# EAGLE design START VARIO (EAGLE 7.5.0)
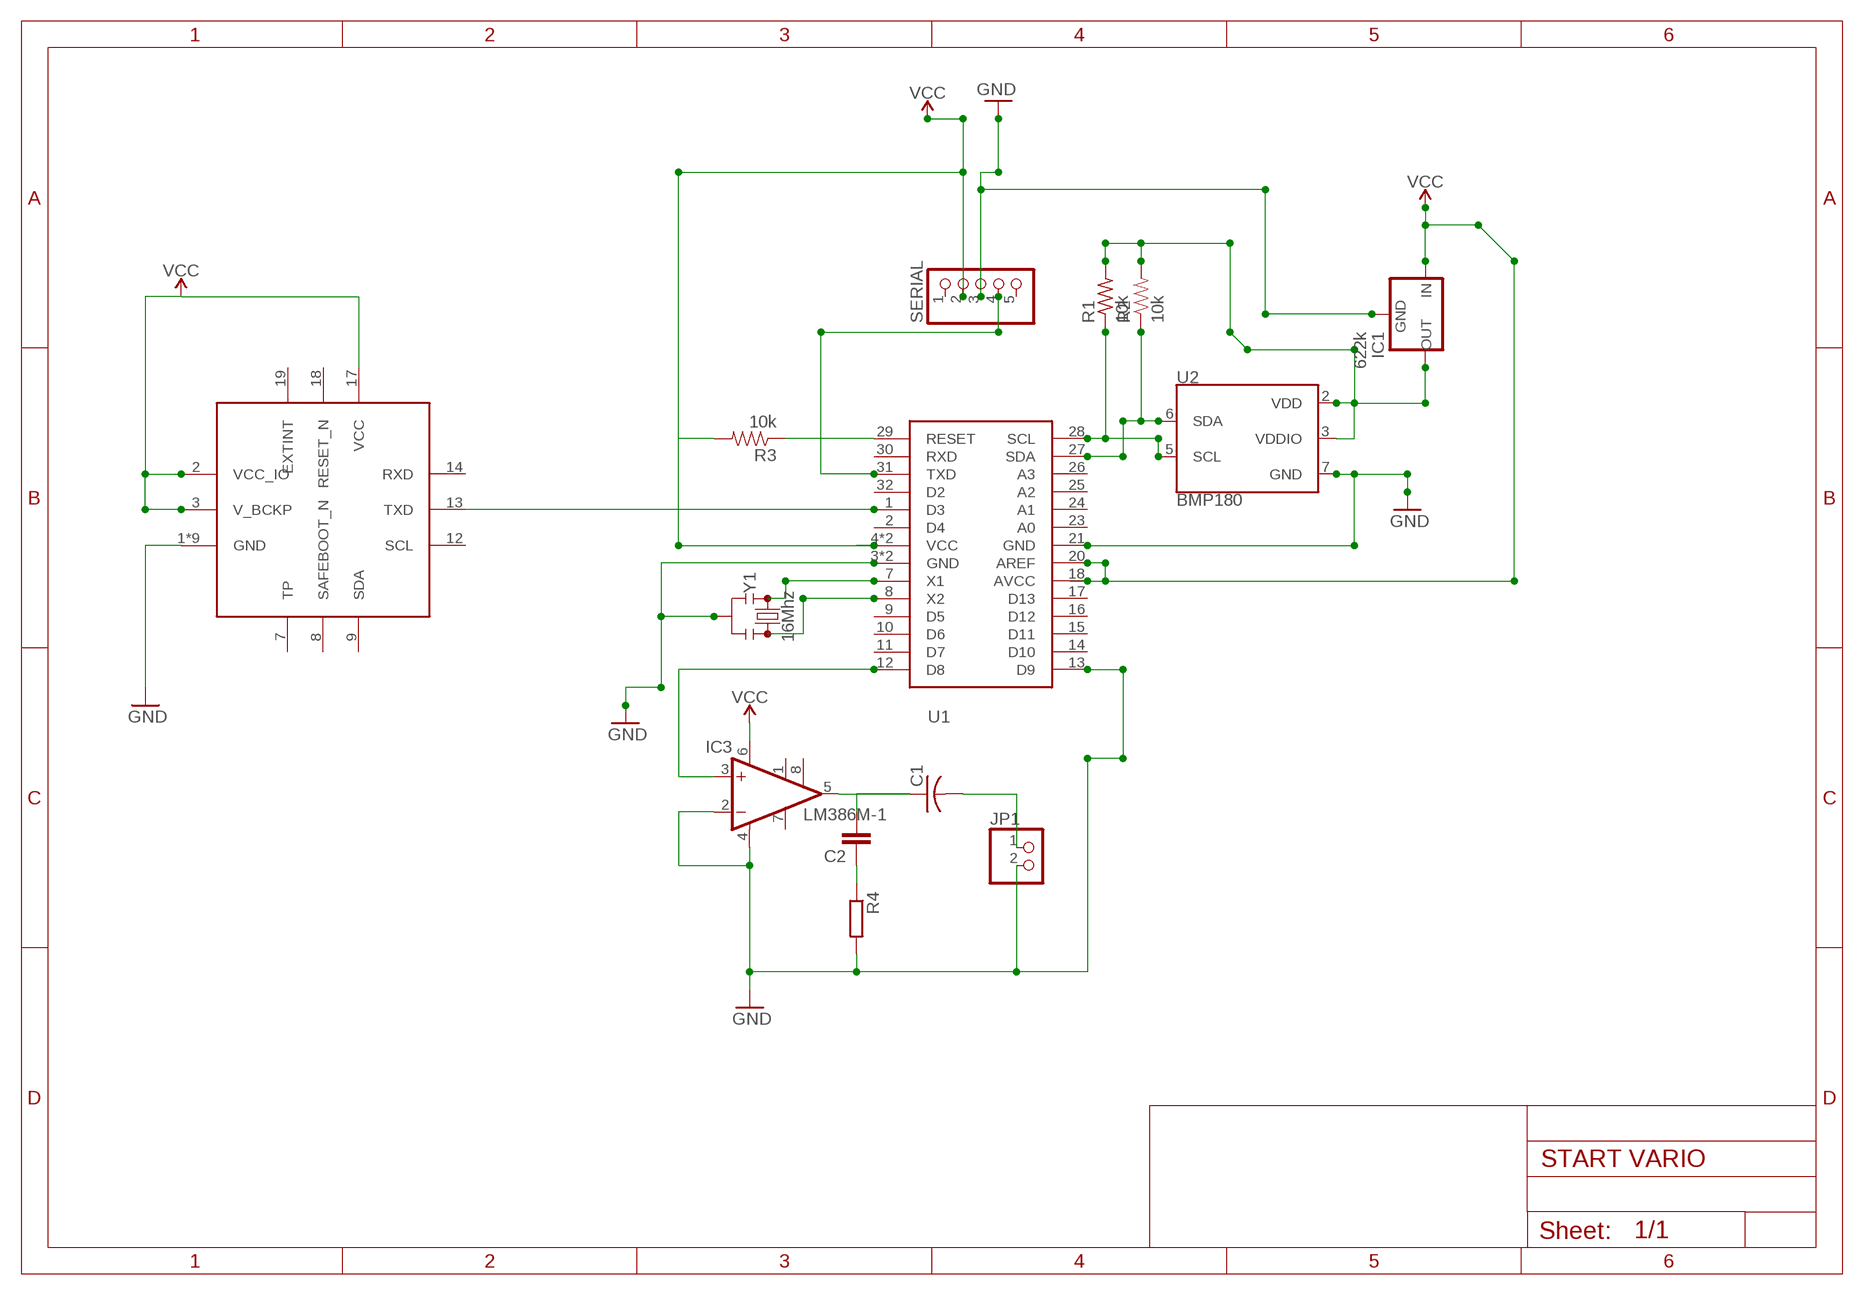
[diagram p0: schematic, sheet 1]

## Parts
C1  C-USC1608  [C1608]
C2  C-EUC0805  [C0805]
IC1  622k  XC63FPM  [SOT23]
IC2  SAM-M8Q  [SAM-M8Q]
IC3  LM386M-1  [SO08]
JP1  PINHD-1X2  [1X02]
R1  10k  R-US_R0805  [R0805]
R2  10k  RESISTOR0603-RES  [0603-RES]
R3  10k  RESISTOR0603-RES  [0603-RES]
R4  R-EU_R0805  [R0805]
SERIAL  PINHD-1X5  [1X05]
U1  ATMEGA328P  [TQFP32-08]
U2  BMP180  [BMP180]
Y1  16Mhz  RESONATORSMD-3.2X1.3  [RESONATOR-SMD-3.2X1.3]

## Nets
CN1: SERIAL.4 U1.31(TXD)
GND: IC1.1(GND) IC2.1(GND) IC2.4(GND) IC2.5(GND) IC2.6(GND) IC2.10(GND) IC2.11(GND) IC2.15(GND) IC2.16(GND) IC2.20(GND) IC3.2(-IN) IC3.4(GND) JP1.2 R4.2 SERIAL.3 U1.3(GND) U1.5(GND) U1.13(D9) U1.21(GND) U2.7(GND) Y1.2
N$1: R2.1 U1.27(SDA) U2.6(SDA)
N$2: R1.1 U1.28(SCL) U2.5(SCL)
N$3: C1.1 C2.2 IC3.5(OUT)
N$4: IC3.3(+IN) U1.12(D8)
N$5: C1.2 JP1.1
N$6: U1.7(X1) Y1.1
N$7: U1.8(X2) Y1.3
N$8: IC1.2(OUT) R1.2 R2.2 U2.2(VDD) U2.3(VDDIO)
N$9: C2.1 R4.1
N$10: R3.1 U1.29(RESET)
N$11: IC2.13(TXD) U1.1(D3)
VCC: IC1.3(IN) IC2.2(VCC_IO) IC2.3(V_BCKP) IC2.17(VCC) IC3.6(VS) R3.2 SERIAL.2 U1.4(VCC) U1.6(VCC) U1.18(AVCC) U1.20(AREF)
Unconnected: IC2.7(TP) IC2.8(SAFEBOOT_N) IC2.9(SDA) IC2.12(SCL) IC2.14(RXD) IC2.18(RESET_N) IC2.19(EXTINT) IC3.1(GAIN) IC3.7(BYPASS) IC3.8(GAIN) SERIAL.1 SERIAL.5 U1.2(D4) U1.9(D5) U1.10(D6) U1.11(D7) U1.14(D10) U1.15(D11) U1.16(D12) U1.17(D13) U1.23(A0) U1.24(A1) U1.25(A2) U1.26(A3) U1.30(RXD) U1.32(D2)

## Library data of the parts
C1 = rcl:C-US: CAPACITOR, American symbol
C2 = resistor:C-EU: CAPACITOR, European symbol
IC1 = v-reg:XC63FP: Positiv Voltage Regulators www.torex.co.jp/english/product/pro02/pdf/0201_xc62fp.pdf
IC2 = ubloxLib:SAM-M8Q: u-blox SAM GNSS antenna module
IC3 = linear:LM386?-*: Low Voltage Audio Power Amplifier Source: http://cache.national.com/ds/LM/LM386.pdf
JP1 = pinhead:PINHD-1X2: PIN HEADER
R1 = adafruit:R-US_: RESISTOR, American symbol
R2 R3 = SparkFun-Passives:RESISTOR: Resistor Basic schematic elements and footprints for 0603, 1206, and PTH resistors.
R4 = resistor:R-EU_: RESISTOR, European symbol
SERIAL = pinhead:PINHD-1X5: PIN HEADER
U1 = lightsuits:ATMEGA328P
U2 = SparkFun-Sensors:BMP180: Bosch BMP180 Digital Barometric Pressures Sensor The BMP180 is the function compatible successor of the BMP085, a new generation of high precision digital pressure sensors for consumer applications. The ultra-low power, low voltage electronics of the BMP180 is optimized for use in mobile phones, PDAs, GPS navigation devices and outdoor equipment. With a low altitude noise of merely 0.25m at fast conversion time, the BMP180 offers superior performance. The I2C interface allows for easy system integration with a microcontroller. The BMP180 is based on piezo-resistive technology for EMC robustness, high accuracy and linearity as well as long term stability. Web page: http://www.bosch-sensortec.com/en/homepage/products_3/environmental_sensors_1/bmp180_1/bmp180 Datasheet: http://ae-bst.resource.bosch.com/media/products/dokumente/bmp180/BST-BMP180-DS000-09.pdf SparkFun Products Barometric Pressure Sensor - BMP180 <https://www.sparkfun.com/products/11823> (COM-11823) SparkFun Barometric Pressure Sensor Breakout - BMP180 <https://www.sparkfun.com/products/11824> (SEN-11824); PROD_ID: IC-11600; SF_ID: 11823
Y1 = SparkFun-Clocks:RESONATOR: Resonators (Generic) Ceramic resonators are clock-generating components, often used to control timing in microcontrollers. They usually have 3 pins: two pins for oscillation, and one pin for ground. Compared to crystals, resonators have worse tolerance, but are usually much cheaper. Plus, they have built-in load capacitors! These devices are used on boards like the Arduino Pro 8MHz <https://www.sparkfun.com/products/11114> and Arduino Pro 16MHz <https://www.sparkfun.com/products/11113>.

## Board
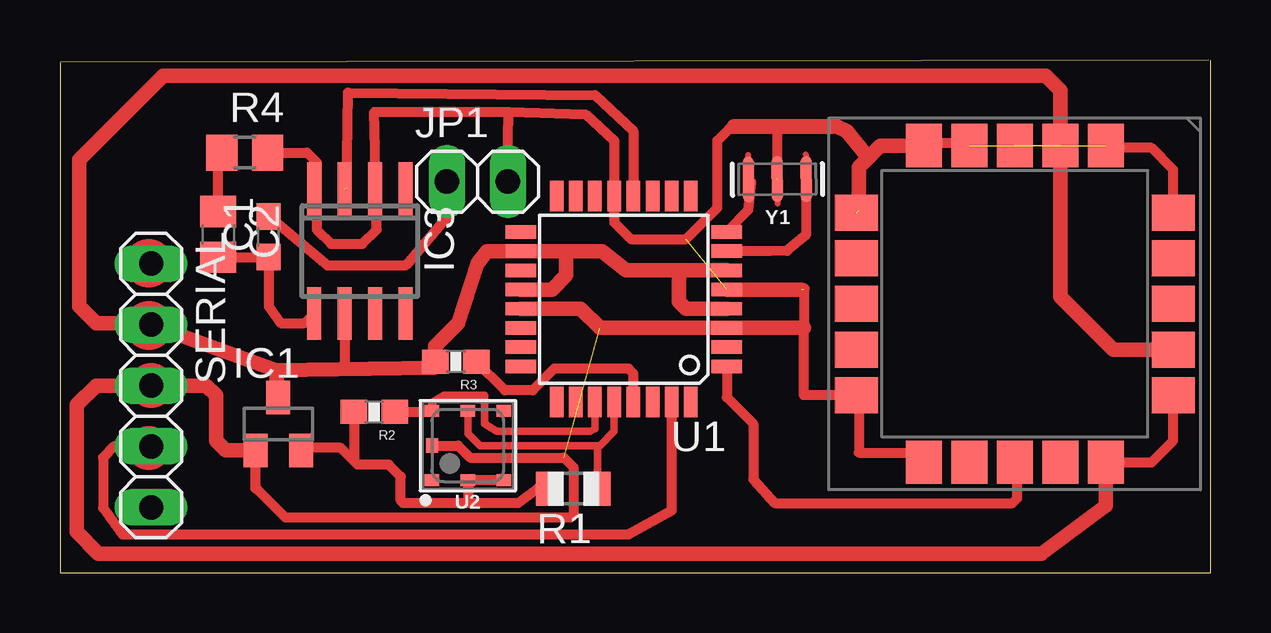
[diagram p1: board, top side]

Size 47.98 x 21.36 mm. Coordinates in mm from the lower left corner, seen from the top.
Outline: 47.87,21.36 0.01,21.26
Outline: 0,21.26 0,0.01
Outline: 0.01,0 47.97,0
Outline: 47.98,0.01 47.98,21.36
Copper layers (1*16): Top 0.0356mm / dielectric 1.5011mm / Bottom 0.0356mm
Design rules "LaenPCBOrder *": minimum track width 6mil, minimum drill 13mil, track to track 6mil, track to pad 6mil, pad to pad 6mil, via to via 6mil, smd to smd 6mil, copper to edge 25mil, drill to drill 6mil, minimum pad ring 7mil, minimum via ring 7mil, stop-mask expansion 3mil, vias tented up to drill 2000mil, thermal gap 10mil

### Footprints (pad centres in the part's own frame; a part is rotated, then mirrored left to right if it is on the bottom)
C1608 = smd 1.1 x 1: 1 -0.85,0; 2 0.85,0
C0805 = smd 1.3 x 1.5: 1 -0.95,0; 2 0.95,0
SOT23 = smd 1 x 1.4: 1 -0.95,-1.1; 2 0.95,-1.1; 3 0,1.1
SAM-M8Q = smd 1.8 x 1.5: 1 -6.6,3.8; 2 -6.6,1.9; 3 -6.6,0; 4 -6.6,-1.9; 5 -6.6,-3.8; 11 6.6,-3.8; 12 6.6,-1.9; 13 6.6,0; 14 6.6,1.9; 15 6.6,3.8 | smd 1.5 x 1.8: 6 -3.8,-6.6; 7 -1.9,-6.6; 8 0,-6.6; 9 1.9,-6.6; 10 3.8,-6.6; 16 3.8,6.6; 17 1.9,6.6; 18 0,6.6; 19 -1.9,6.6; 20 -3.8,6.6
SO08 = smd 0.6 x 2.2: 1 -1.905,-2.6; 2 -0.635,-2.6; 3 0.635,-2.6; 4 1.905,-2.6; 5 1.905,2.6; 6 0.635,2.6; 7 -0.635,2.6; 8 -1.905,2.6
1X02 = drill 1.016 long: 1 -1.27,0; 2 1.27,0
R0805 = smd 1.1 x 1.4: 1 -1,0; 2 1,0
0603-RES = smd 1.1 x 1: 1 -0.85,0; 2 0.85,0
R0805' = smd 1.3 x 1.5: 1 -0.95,0; 2 0.95,0
1X05 = drill 1.016 long: 1 -5.08,0; 2 -2.54,0; 3 0,0; 4 2.54,0; 5 5.08,0
TQFP32-08 = smd 1.27 x 0.559: 1 -4.293,2.8; 2 -4.293,2; 3 -4.293,1.2; 4 -4.293,0.4; 5 -4.293,-0.4; 6 -4.293,-1.2; 7 -4.293,-2; 8 -4.293,-2.8; 17 4.293,-2.8; 18 4.293,-2; 19 4.293,-1.2; 20 4.293,-0.4; 21 4.293,0.4; 22 4.293,1.2; 23 4.293,2; 24 4.293,2.8 | smd 0.559 x 1.27: 9 -2.8,-4.293; 10 -2,-4.293; 11 -1.2,-4.293; 12 -0.4,-4.293; 13 0.4,-4.293; 14 1.2,-4.293; 15 2,-4.293; 16 2.8,-4.293; 25 2.8,4.293; 26 2,4.293; 27 1.2,4.293; 28 0.4,4.293; 29 -0.4,4.293; 30 -1.2,4.293; 31 -2,4.293; 32 -2.8,4.293
BMP180 = smd 0.6 x 0.5: 1 1.5,1.45; 2 0,1.45; 3 -1.5,1.45; 4 -1.5,-1.45; 5 0,-1.45; 6 1.5,-1.45 | smd 0.5 x 0.6: 7 1.5,0
RESONATOR-SMD-3.2X1.3 = smd 0.45 x 1.905: 1 -1.2,0; 2 0,0; 3 1.2,0

### Placement (x,y rotation side)
C1  8.7,14 90 top
C2  6.6,14.1 270 top
IC1  9.1,6.2 0 top
IC2  39.8,11.2 270 top
IC3  12.5,13.4 180 top
JP1  17.4,16.3 0 top
R1  21.4,3.5 180 top
R2  13.1,6.7 180 top
R3  16.5,8.8 180 top
R4  [R0805']  7.7,17.5 0 top
SERIAL  3.8,7.8 270 top
U1  23.5,11.4 180 top
U2  17,5.3 180 top
Y1  29.9,16.4 180.4 top

### Tracks (layer width: path | path; a pad name or v marks a point on that pad's centre or on a via)
CN1
  Top 0.406: SERIAL.4 2.26,5.26 1.8,4.8 1.8,2.7 2.6,1.6 23.7,1.6 25.5,2.6 U1.31
GND  (6 unrouted)
  Top 0.406: 46.2,7.2 IC2.16 46.4,5.5 45.5,4.6 IC2.15 43.5,4.7 | IC2.6 33.2,14.9 33,14.7 | 31,11.8 31.05,11.85 31,11.85 31,10.2 31,7.4 IC2.10 33.3,7.3 33.3,5 35.6,5 IC2.11 | Y1.2 29.9,18.6 | U2.7 16.6,5.3 17.1,4.8 21,4.8 21.4,4.4 21.4,2.4 21.3,2.3 9.4,2.3 8.2,3.5 8.15,3.5 IC1.1 | R4.2 10.3,17.5 10.7,17.1 10.7,16.11 | 10.7,16.11 IC3.4 | 10.7,16.11 10.7,14.3 11.3,13.7 12.6,13.7 13.2,14.3 13.2,15.94 IC3.2 13.13,17.64 13.1,19.2 18.7,19.2 | 18.7,19.2 21.9,19.1 23.1,18 U1.13 23.1,14.6 23.8,13.9 26.1,13.9 27.4,15.2 27.4,18 27.9,18.5 32.26,18.5 32.35,18.6 | JP1.2 18.67,18.07 18.7,19.2 | IC2.4 37.9,17.9 35.6,17.9 35.5,17.8 | IC2.20 46.4,16.8 45.5,17.7 43.7,17.7 IC2.1
  Top 0.61: IC2.5 35.5,17.8 34.2,17.8 33.7,17.3 | 33.7,17.3 33.3,16.9 33.3,15.1 | 31,10.2 U1.3 22.5,10.2 21.7,11 U1.21 | 28.1,18.6 29.9,18.6 32.1,18.6 32.35,18.6 32.8,18.4 33.7,17.3 | U1.5 30.9,11.8 | IC2.15 43.6,2.8 40.9,0.8 1.6,0.8 0.7,1.7 0.7,7 1.5,7.8 SERIAL.3 6.1,7.8 6.5,7.4 6.5,5.5 6.9,5.1 IC1.1
N$1
  Top 0.305: U2.6 15.5,7.1 16,7.4 17.7,7.4 17.7,6.2 18.2,5.9 22.1,5.9 22.3,6 U1.27
  Top 0.406: R2.1 15.5,6.7 U2.6
N$2
  Top 0.305: U1.28 23.1,5.9 22.5,5.3 | 22.5,5.3 17.5,5.3 17,5.8 U2.5 | R1.1 22.4,5.2 22.5,5.3
N$3
  Top 0.406: C2.2 C1.1 8.7,11.1 9.2,10.4 10.2,10.4 IC3.5
N$4  (1 unrouted)
  Top 0.406: 11.95,16.05 12,20 22.3,19.9 23.9,18.4 U1.12
N$5
  Top 0.406: JP1.1 16.13,14.83 14.4,12.8 11.15,12.8 C1.2
N$6
  Top 0.406: 31.11,14.09 30.31,13.41 29.6,13.4 U1.7
N$7
  Top 0.406: 28.81,16.28 28.68,15.11 U1.8
N$8
  Top 0.406: R1.2 19.9,3.5 19.1,2.9 17.1,2.9 | 17.1,2.9 14.3,2.9 14.2,3 14.2,4 13.7,4.5 12.4,4.5 12.25,4.65 | 12.25,4.65 11.7,5.2 10.05,5.2 IC1.2 | 17.1,2.9 17,3 U2.2 U2.3 | R2.2 12.25,4.65
N$9
  Top 0.406: C2.1 6.6,17.35 R4.1
N$10
  Top 0.406: U1.29 23.9,8.3 23.7,8.5 20.6,8.5 19.7,7.6 18.55,7.6 R3.1
N$11
  Top 0.406: U1.1 27.79,7.31 28.9,6.2 28.9,3.9 29.8,2.9 39.7,2.9 39.9,3.1 39.9,4.5 IC2.13
N$12  (via drill 0.9)
  other vias: 3.8,10.4
N$15
  Top 0.406: 31.1,16.2 31.1,14.1
N$17  (via drill 0.9)
  other vias: 3.8,5.3
VCC  (1 unrouted)
  Top 0.406: U1.18 21.1,13.4 | U1.6 27.9,12.5 | 3.74,10.4 SERIAL.2 | 15.55,8.69 15.6,8.54 | IC3.6 11.87,8.44 12.91,8.5
  Top 0.61: SERIAL.2 9,8.44 | 9,8.44 12.91,8.5 15.6,8.54 15.64,9.44 16.6,10.4 17.4,12.9 17.8,13.4 U1.18 22.6,13.4 23.6,12.6 25.8,12.6 | 21.1,13.4 21.1,12.4 20.5,11.8 U1.20 | IC1.3 9,8.44 | 25.8,12.6 U1.6 | 3.74,10.4 1.5,10.4 0.8,11.1 0.8,17.2 4.3,20.7 41.1,20.7 41.7,20.1 IC2.2 41.7,11.5 43.9,9.3 IC2.17 | U1.4 26.1,11 25.8,11.3 25.8,12.6 | R3.2 15.55,8.69
(copper drawn outside any net)
  shapes: Top circle x16